# Altium schematic sheet SD CARD .SchDoc: SIM868 Development Board
size 149 x 200 mm; SheetNumber: 10; SheetTotal: 14
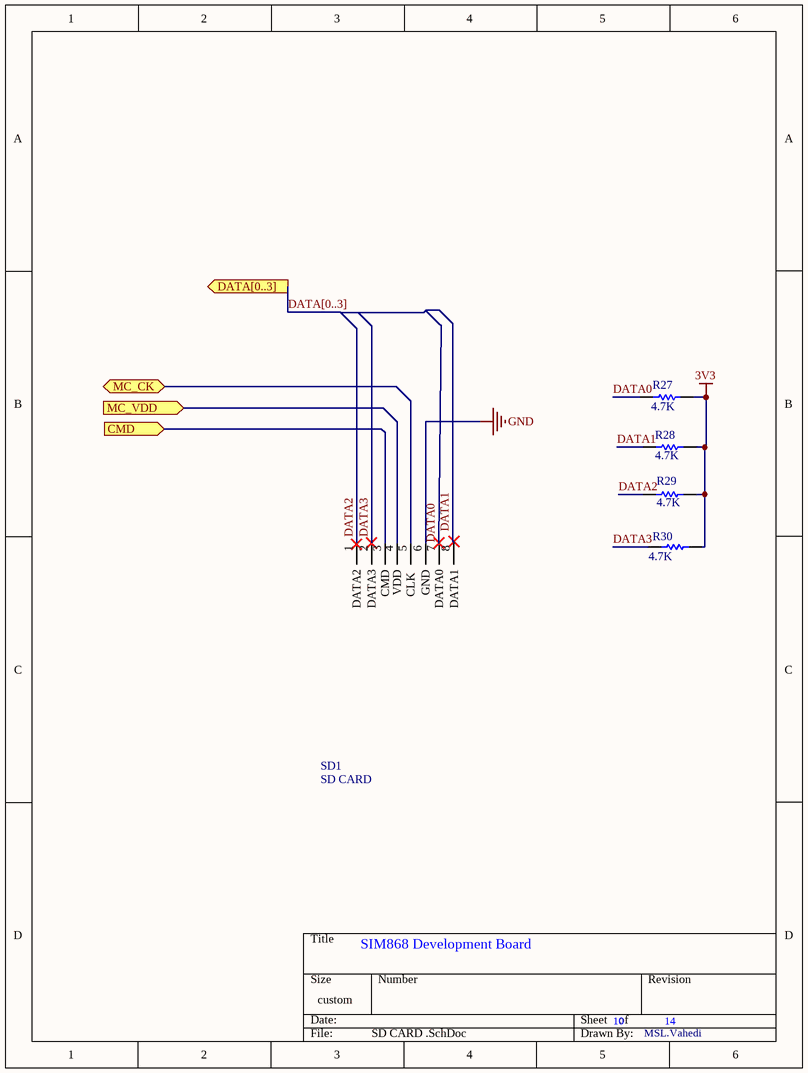
[diagram p0: SD CARD .SchDoc]

## Parts
R27  value 4.7K  [RES0805]
R28  value 4.7K  [RES0805]
R29  value 4.7K  [RES0805]
R30  value 4.7K  [RES0805]
SD1  SD CARD  [SD_CARD]

## Ports
CMD (in), DATA[0..3] (out), MC_CK (bidir), MC_VDD (in)

## Nets
3V3: R27.2 R28.2 R29.2 R30.2
GND: SD1.6(GND)
CMD: SD1.3(CMD) ; port CMD
DATA0: R27.1 SD1.7(DATA0)
DATA1: R28.1 SD1.8(DATA1)
DATA2: R29.1 SD1.1(DATA2)
DATA3: R30.1 SD1.2(DATA3)
MC_CK: SD1.5(CLK) ; port MC_CK
MC_VDD: SD1.4(VDD) ; port MC_VDD

## Buses and harness runs
bus DATA[0..3] = port DATA[0..3]

## Notes on the sheet
- MSL.Vahedi

## Library data of the parts
R27-R30 = Res1: Resistor; Published: 8-Jun-2000; LatestRevisionDate: 17-Jul-2002; LatestRevisionNote: Re-released for DXP Platform.; PackageReference: AXIAL-0.3; Publisher: Altium Limited; PackageDescription: Axial Device, Thru-Hole; 2 Leads; 0.3 in Pin Spacing